# Altium schematic sheet 5V_board.SchDoc
size A4
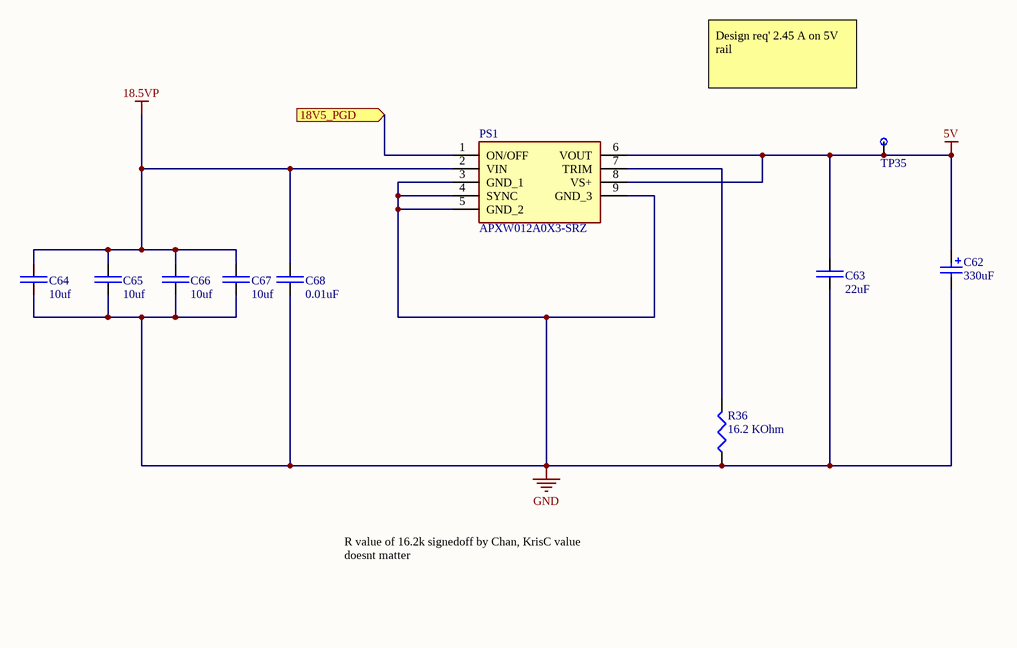
[diagram p0: 5V_board.SchDoc]

## Parts
C62  330uF  [330uF throught hole]
C63  22uF  [22uF Capacitor]
C64  10uf  [10uF capacitor LPB]
C65  10uf  [10uF capacitor LPB]
C66  10uf  [10uF capacitor LPB]
C67  10uf  [10uF capacitor LPB]
C68  0.01uF  [0.01uF capacitor]
PS1  APXW012A0X3-SRZ  [APXW012A0X3SRZ]
R36  16.2 KOhm  [16.2 KOhm Resistor]
TP35  TestPt  [50_MIL_PAD]  (value not drawn)

## Ports
18V5_PGD (in)

## Nets
5V: C62.1 C63.2 PS1.6(VOUT) PS1.8(VS+) TP35.1
18.5VP: C64.2 C65.2 C66.2 C67.2 C68.2 PS1.2(VIN)
GND: C62.2 C63.1 C64.1 C65.1 C66.1 C67.1 C68.1 PS1.3(GND_1) PS1.4(SYNC) PS1.5(GND_2) PS1.9(GND_3) R36.1
18V5_PGD: PS1.1(ON/OFF) ; port 18V5_PGD
NetPS1_7: PS1.7(TRIM) R36.2

## Notes on the sheet
- Design req' 2.45 A on 5V rail
- R value of 16.2k signedoff by Chan, KrisC value doesnt matter

## Library data of the parts
C62 = 35ZLH330MEFCT810X12.5: CAP ALUM 330UF 20% 35V RADIAL; Manufacturer 1: Rubycon; Ripple Current: 731.5mA; Impedance: 39mR; Life (Hours): 10000Hour; Supplier 1: Digi-Key; Supplier Part Number 1: 1189-3752-1-ND; Manufacturer Part Number 1: 35ZLH330MEFCT810X12.5; Stock 1: 14330; Pricing 1: 1=0,52000, 10=0,36900, 100=0,24280 (USD); RoHS: Yes; Mount: Through Hole; Case/Package: Radial; Min Operating Temperature: -40°C; Max Operating Temperature: 105°C; Package Quantity: 1000; Capacitance: 330uF; Packaging: Tape and Reel; Tolerance: 20%; Voltage Rating: 35V; Lead Pitch: 0.197inch; Height - Seated (Max): 0.551inch; ComponentLink1URL: http://www.rubycon.co.jp/en/catalog/e_pdfs/aluminum/e_ZLH.pdf?src-supplier=Digi-Key; ComponentLink1Description: http://www.rubycon.co.jp/en/catalog/e_pdfs/aluminum/e_ZLH.pdf?src-supplier=Digi-Key; ComponentLink2URL: http://www.rubycon.co.jp/en/catalog/e_pdfs/aluminum/Radial_Lead_Alumi_Eng.pdf?src-supplier=Digi-Key; ComponentLink2Description: http://www.rubycon.co.jp/en/catalog/e_pdfs/aluminum/Radial_Lead_Alumi_Eng.pdf?src-supplier=Digi-Key
C63 = GRM32ER71E226KE15L: Cap Ceramic 22uF 25V X7R 10% SMD 1210 125C Embossed T/R; Manufacturer 1: Murata; Supplier 1: Digi-Key; Supplier Part Number 1: 490-5313-6-ND; Manufacturer Part Number 1: GRM32ER71E226KE15L; Stock 1: 52660; Pricing 1: 1=1,78000, 10=1,40600, 100=1,05410, 500=0,79646 (USD); RoHS: Yes; Mount: Surface Mount; Case/Package: 1210; Number of Pins: 2; Case Code (Metric): 3225; Case Code (Imperial): 1210; Material: Ceramic; Min Operating Temperature: -55°C; Max Operating Temperature: 125°C; Capacitance: 22uF; Tolerance: 10%; Dielectric: X7R; Voltage Rating: 25V; Packaging: Tape and Reel; Package Quantity: 1; Voltage Rating (DC): 25V; Termination: SMD/SMT; Voltage: 25V; Length: 3.2mm; Height: 2.5mm; Width: 0.098inch; Thickness: 0.106inch; Depth: 2.5mm; Radiation Hardening: No; REACH SVHC: No SVHC; Lead Free: Lead Free; ComponentLink1URL: https://datasheet.ciiva.com/6072/1697714-6072768.pdf?src-supplier=Farnell; ComponentLink1Description: https://datasheet.ciiva.com/6072/1697714-6072768.pdf?src-supplier=Farnell; ComponentLink2URL: https://datasheet.ciiva.com/16497/product-16497009.pdf?src-supplier=Future+Electronics; ComponentLink2Description: https://datasheet.ciiva.com/16497/product-16497009.pdf?src-supplier=Future+Electronics; ComponentLink3URL: https://datasheet.ciiva.com/3776/2741grm32er71e226ke1523-3776996.pdf?src-supplier=Arrow; ComponentLink3Description: https://datasheet.ciiva.com/3776/2741grm32er71e226ke1523-3776996.pdf?src-supplier=Arrow; ComponentLink4URL: https://datasheet.ciiva.com/11789/0900766b80ef921d-11789129.pdf?src-supplier=RSComponents; ComponentLink4Description: https://datasheet.ciiva.com/11789/0900766b80ef921d-11789129.pdf?src-supplier=RSComponents; ComponentLink5URL: https://datasheet.ciiva.com/29201/451826-da-01-de-vs-kondens-grm32-er71e-226ke15l-29201795.pdf?src-supplier=Conrad; ComponentLink5Description: https://datasheet.ciiva.com/29201/451826-da-01-de-vs-kondens-grm32-er71e-226ke15l-29201795.pdf?src-supplier=Conrad; ComponentLink6URL: https://datasheet.ciiva.com/175/partnumbering-e-01-175746.pdf?src-supplier=Digi-Key; ComponentLink6Description: https://datasheet.ciiva.com/175/partnumbering-e-01-175746.pdf?src-supplier=Digi-Key; ComponentLink7URL: https://datasheet.ciiva.com/175/partnumbering-e-01-175747.pdf?src-supplier=Digi-Key; ComponentLink7Description: https://datasheet.ciiva.com/175/partnumbering-e-01-175747.pdf?src-supplier=Digi-Key; ComponentLink8URL: https://datasheet.ciiva.com/175/partnumbering-e-01-175748.pdf?src-supplier=Digi-Key; ComponentLink8Description: https://datasheet.ciiva.com/175/partnumbering-e-01-175748.pdf?src-supplier=Digi-Key; ComponentLink9URL: https://datasheet.ciiva.com/22703/1697714-22703397.pdf?src-supplier=Element14; ComponentLink9Description: https://datasheet.ciiva.com/22703/1697714-22703397.pdf?src-supplier=Element14; Category: Capacitor
C64-C67 = GRT31CR61H106ME01L: CAP CER 10UF 50V X5R 1206; Manufacturer 1: Murata; Tolerance: 20%; Supplier 1: Digi-Key; Supplier Part Number 1: 490-12457-1-ND; Manufacturer Part Number 1: GRT31CR61H106ME01L; Stock 1: 8159; Pricing 1: 1=0,50000, 10=0,34900, 100=0,20920, 500=0,15690, 1000=0,13249 (USD); RoHS: Yes; Mount: Surface Mount; Case/Package: 1206; Case Code (Metric): 3216; Case Code (Imperial): 1206; Min Operating Temperature: -55°C; Max Operating Temperature: 85°C; Packaging: Tape and Reel; Capacitance: 10uF; Voltage Rating: 50V; Length: 0.126inch; Width: 0.063inch; Thickness: 0.071inch; Ratings: AEC-Q200; ComponentLink1URL: http://search.murata.co.jp/Ceramy/image/img/A01X/G101/ENG/GRT31CR61H106ME01-01.pdf?src-supplier=Digi-Key; ComponentLink1Description: http://search.murata.co.jp/Ceramy/image/img/A01X/G101/ENG/GRT31CR61H106ME01-01.pdf?src-supplier=Digi-Key; Category: Capacitor
C68 = C0603C103KARACAUTO: Cap Ceramic 0.01uF 250V X7R 10% Pad SMD 0603 125C Automotive T/R; Manufacturer 1: KEMET; Capacitance: 10nF; Supplier 1: Digi-Key; Supplier Part Number 1: 399-17960-1-ND; Manufacturer Part Number 1: C0603C103KARACAUTO; Stock 1: 8483; Pricing 1: 1=0,90000, 10=0,68500, 100=0,49040, 500=0,37964, 1000=0,32691 (USD); RoHS: No; Mount: Surface Mount; Case/Package: 0603; Case Code (Imperial): 0603; Case Code (Metric): 1608; Min Operating Temperature: -55°C; Max Operating Temperature: 125°C; Packaging: Tape and Reel; Tolerance: 10%; Voltage Rating: 250V; Ratings: AEC-Q200; ComponentLink1URL: https://api.kemet.com/component-edge/download/datasheet/C0603C103KARACAUTO.pdf?src-supplier=Digi-Key; ComponentLink1Description: https://api.kemet.com/component-edge/download/datasheet/C0603C103KARACAUTO.pdf?src-supplier=Digi-Key; Category: Capacitor
PS1 = APXW012A0X3-SRZ: Power Supply; Manufacturer_Name: ABB; Datasheet Link: https://datasheet.datasheetarchive.com/originals/distributors/Datasheets_SAMA/683ccf345f63793608341fe806dd9fff.pdf; Height: 10mm; Manufacturer_Part_Number: APXW012A0X3-SRZ; Mouser Part Number: 894-APXW012A0X3-SRZ; Mouser Price/Stock: https://www.mouser.co.uk/ProductDetail/ABB/APXW012A0X3-SRZ?qs=R2DZpqZpp70Xpp2aKRKJXQ%3D%3D
R36 = RT0603DRD0716K2L: RES SMD 16.2KOHM 0.5% 1/10W 0603; Manufacturer 1: Yageo; Resistance: 16.2kR; Max Power Dissipation: 100mW; Temperature Coefficient: 25ppm/°C; Voltage Rating (DC): 50V; Supplier 1: Digi-Key; Supplier Part Number 1: 311-16.2KDCT-ND; Manufacturer Part Number 1: RT0603DRD0716K2L; Stock 1: 8163; Pricing 1: 1=0,20000, 10=0,16800, 100=0,06570, 1000=0,02750, 2500=0,02521 (USD); RoHS: Yes; Case/Package: 0603; Case Code (Metric): 1608; Case Code (Imperial): 0603; Min Operating Temperature: -55°C; Max Operating Temperature: 155°C; Package Quantity: 1; Tolerance: 0.5%; Packaging: Tape and Reel; Composition: Thin Film; Number of Terminations: 2; Features: Moisture Resistant; Length: 0.063inch; Height: 0.022inch; Width: 0.031inch; Lead Free: Lead Free; ComponentLink1URL: http://www.yageo.com/documents/recent/PYu-RT_1-to-0.01_RoHS_L_8.pdf?src-supplier=Digi-Key; ComponentLink1Description: http://www.yageo.com/documents/recent/PYu-RT_1-to-0.01_RoHS_L_8.pdf?src-supplier=Digi-Key; Category: Resistors